# EAGLE schematic LaunchFET-iso (EAGLE 6.3)
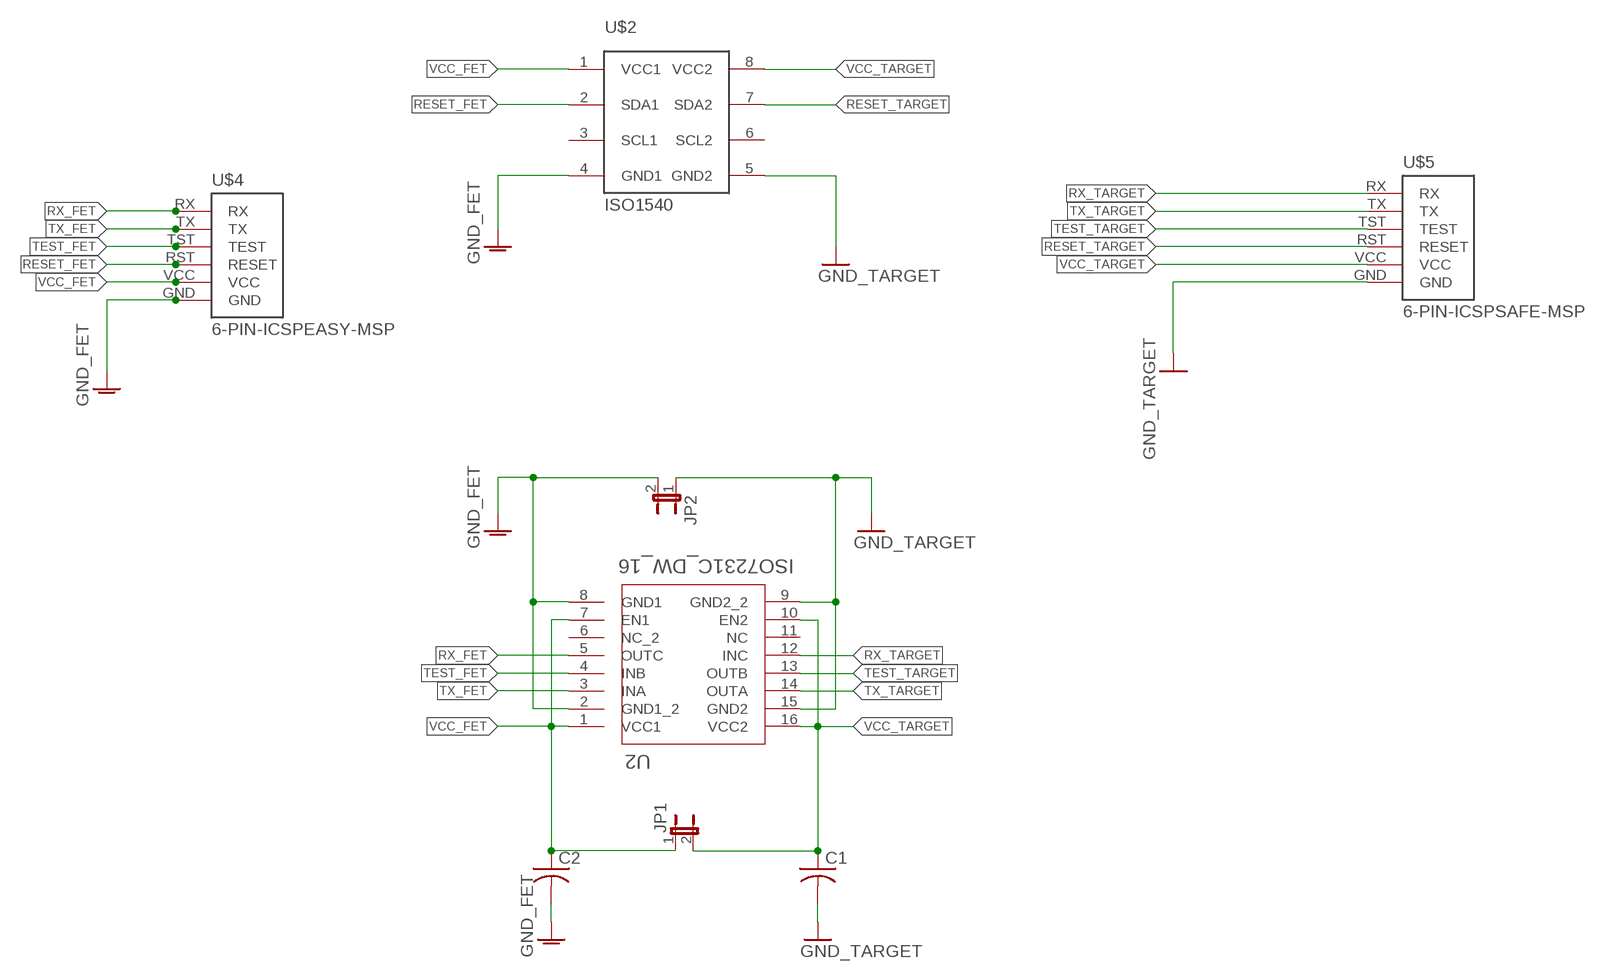
[diagram p0: schematic, sheet 1]

## Parts
C1  C-USC1206  [C1206]
C2  C-USC1206  [C1206]
JP1  JUMPER-2PTH_LOCK  [1X02_LOCK]
JP2  JUMPER-2PTH_LOCK  [1X02_LOCK]
U2  ISO7231C_DW_16  [DW16]
U$2  ISO1540  [D8]
U$4  6-PIN-ICSPEASY-MSP  [EASYMSP-6PIN]
U$5  6-PIN-ICSPSAFE-MSP  [SAFEMSP-6PIN]

## Nets
GND_FET: C2.2 JP2.2 U2.2(GND1_2) U2.8(GND1) U$2.4(GND1) U$4.GND
GND_TARGET: C1.2 JP2.1 U2.9(GND2_2) U2.15(GND2) U$2.5(GND2) U$5.GND
RESET_FET: U$2.2(SDA1) U$4.RST(RESET)
RESET_TARGET: U$2.7(SDA2) U$5.RST(RESET)
RX_FET: U2.5(OUTC) U$4.RX
RX_TARGET: U2.12(INC) U$5.RX
TEST_FET: U2.4(INB) U$4.TST(TEST)
TEST_TARGET: U2.13(OUTB) U$5.TST(TEST)
TX_FET: U2.3(INA) U$4.TX
TX_TARGET: U2.14(OUTA) U$5.TX
VCC_FET: C2.1 JP1.1 U2.1(VCC1) U2.7(EN1) U$2.1(VCC1) U$4.VCC
VCC_TARGET: C1.1 JP1.2 U2.10(EN2) U2.16(VCC2) U$2.8(VCC2) U$5.VCC
Unconnected: U2.6(NC_2) U2.11(NC) U$2.3(SCL1) U$2.6(SCL2)

## Library data of the parts
C1 C2 = adafruit:C-US: CAPACITOR, American symbol
JP1 JP2 = SparkFun-Passives:JUMPER-2: Jumper Basic 0.1" spaced jumper. Use with breakaway headers.
U2 = TI:ISO7231C_DW_16; DATASHEETURL: http://www.ti.com/lit/gpn/ISO7231C; DESCRIPTION: Triple Channel, 2/1, 25Mbps, Digital Isolator; FAMILY_NAME: ISOLATOR; GENERIC_PART_NUMBER: ISO7231C; INDUSTRY_STD_PKG_TYPE: SOIC; MANUFACTURER: Texas Instruments; MANUFACTURER_PART_NUMBER: iso7231c_dw_16; PACKAGE_DESIGNATOR: DW; PIN_COUNT: 16; VENDOR: Texas Instruments
U$2 = TI:ISO1540
U$4 U$5 = LaunchFET:6-PIN-ICSP: 6 pin easy-msp formatted headers. Designed to make programming target boards with MSP430 Launchpad easier. EASYMSP: standard .05" pitch header to match launchpad SAFEMSP: .05" header with .025" offset Vcc to keep Geordi away